# EAGLE design IvoOerlikon3 (EAGLE 7.6.0)

## Sheet 1 of 2
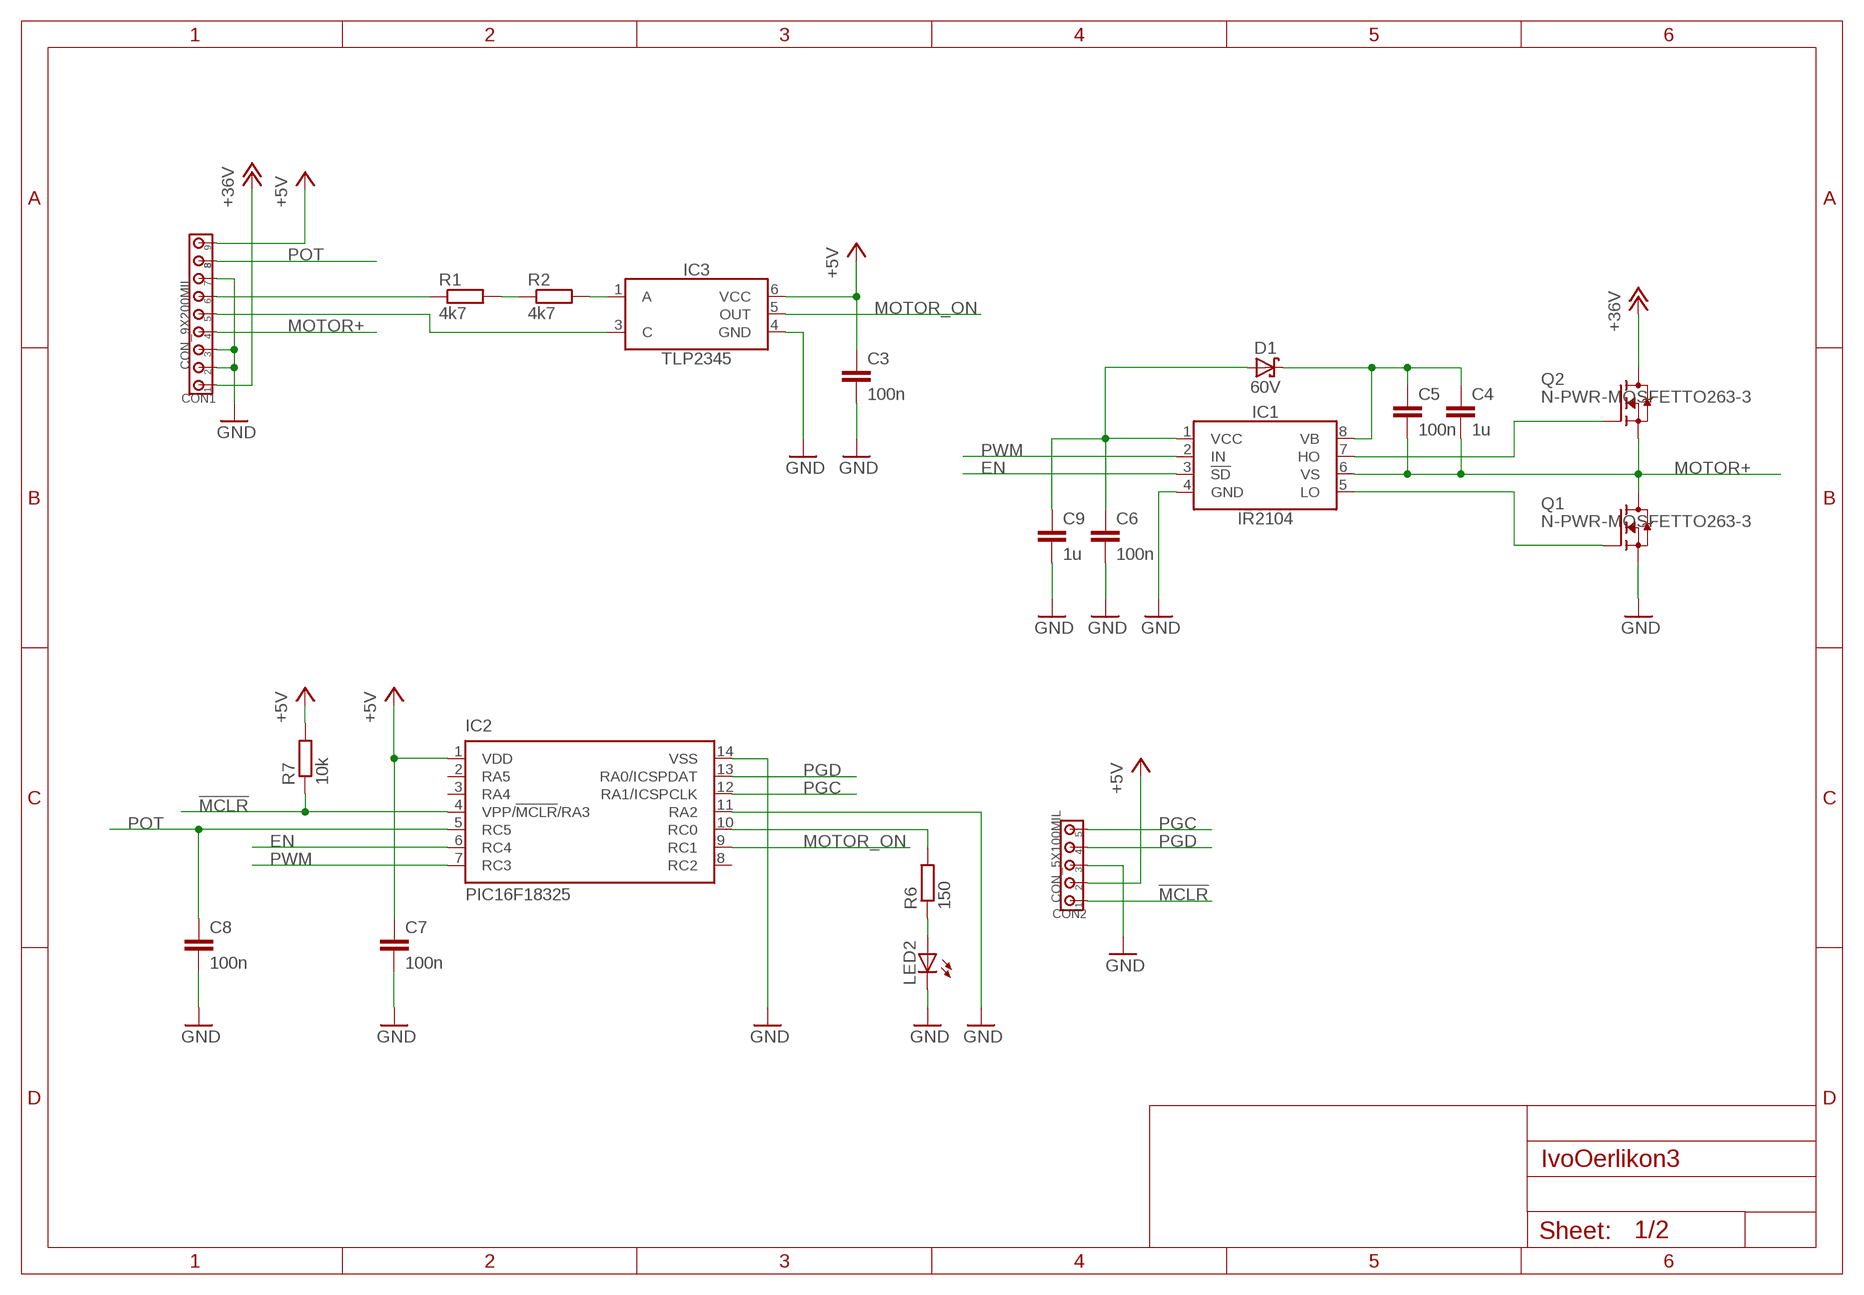
[diagram p0: schematic, sheet 1]

### Parts
C3  100n  CC0805  [C0805]
C4  1u  CC0805  [C0805]
C5  100n  CC0805  [C0805]
C6  100n  CC0805  [C0805]
C7  100n  CC0805  [C0805]
C8  100n  CC0805  [C0805]
C9  1u  CC0805  [C0805]
CON1  CON_9X200MIL  [200MIL_9X]
CON2  CON_5X100MIL  [100MIL_5X]
D1  60V  SCHOTTKYSOD123  [SOD123]
IC1  IR2104  [SOIC8]
IC2  PIC16F18325  [SO14]
IC3  TLP2345  [SO6]
LED2  LED0805  [LED0805]
Q1  N-PWR-MOSFETTO263-3  [TO263-3]
Q2  N-PWR-MOSFETTO263-3  [TO263-3]
R1  4k7  RESISTORR1206  [R1206]
R2  4k7  RESISTORR1206  [R1206]
R6  150  RESISTORR0805  [R0805]
R7  10k  RESISTORR0805  [R0805]

### Nets
!MCLR!: CON2.1 IC2.4(VPP/!MCLR!/RA3) R7.1
+5V: C3.1 C7.1 CON1.9 CON2.2 IC2.1(VDD) IC3.6(VCC) R7.2 ; also sheet 2
+36V: CON1.1 Q2.TAB(D) ; also sheet 2
EN: IC1.3(!SD!) IC2.6(RC4)
GND: C3.2 C6.2 C7.2 C8.2 C9.2 CON1.2 CON1.3 CON1.7 CON2.3 IC1.4(GND) IC2.11(RA2) IC2.14(VSS) IC3.4(GND) LED2.C Q1.3(S) ; also sheet 2
MOTOR+: C4.2 C5.2 CON1.4 IC1.6(VS) Q1.TAB(D) Q2.3(S)
MOTOR_ON: IC2.9(RC1) IC3.5(OUT)
N$1: R1.2 R2.1
N$2: IC1.5(LO) Q1.1(G)
N$4: IC3.1(A) R2.2
N$6: IC1.7(HO) Q2.1(G)
N$8: C4.1 C5.1 D1.C IC1.8(VB)
N$11: LED2.A R6.1
N$12: IC2.10(RC0) R6.2
N$13: CON1.6 R1.1
N$14: CON1.5 IC3.3(C)
N$17: C6.1 C9.1 D1.A IC1.1(VCC)
PGC: CON2.5 IC2.12(RA1/ICSPCLK)
PGD: CON2.4 IC2.13(RA0/ICSPDAT)
POT: C8.1 CON1.8 IC2.5(RC5)
PWM: IC1.2(IN) IC2.7(RC3)
Unconnected: IC2.2(RA5) IC2.3(RA4) IC2.8(RC2)

## Sheet 2 of 2
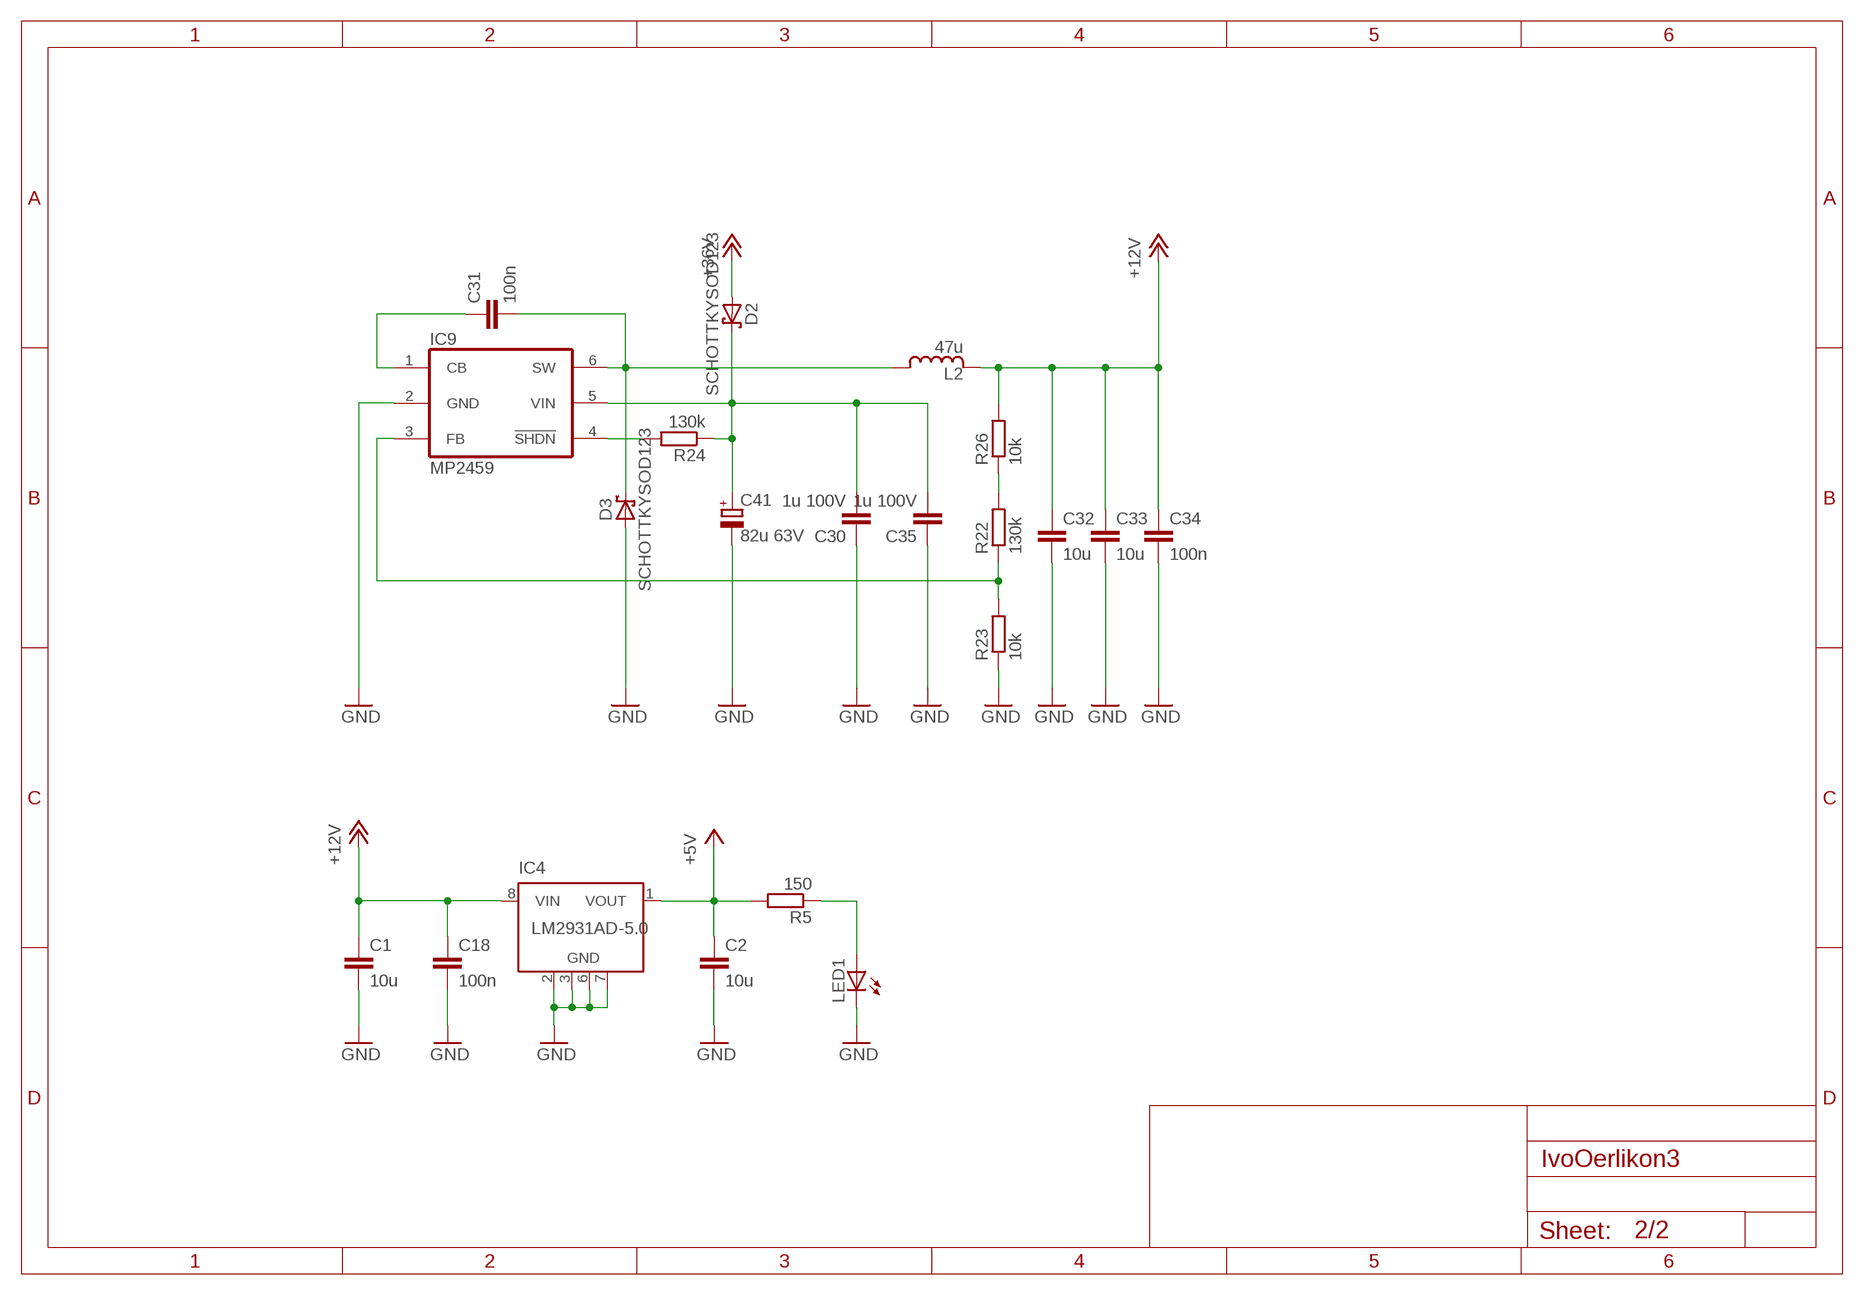
[diagram p1: schematic, sheet 2]

### Parts
C1  10u  CC1206  [C1206]
C2  10u  CC1206  [C1206]
C18  100n  CC0805  [C0805]
C30  1u 100V  CC0805  [C0805]
C31  100n  CC0805  [C0805]
C32  10u  CC1206  [C1206]
C33  10u  CC1206  [C1206]
C34  100n  CC0805  [C0805]
C35  1u 100V  CC0805  [C0805]
C41  82u 63V  C_POLARIZED8MM  [8MM]
D2  SCHOTTKYSOD123  [SOD123]
D3  SCHOTTKYSOD123  [SOD123]
IC4  LM2931AD-5.0  [SOIC8]
IC9  MP2459  LMR16006  [SOT-32-6]
L2  47u  INDUCTORSRN5040  [SRN5040]
LED1  LED0805  [LED0805]
R5  150  RESISTORR0805  [R0805]
R22  130k  RESISTORR0805  [R0805]
R23  10k  RESISTORR0805  [R0805]
R24  130k  RESISTORR0805  [R0805]
R26  10k  RESISTORR0805  [R0805]

### Nets
+5V: C2.1 IC4.1(VOUT) R5.2 ; also sheet 1
+12V: C1.1 C18.1 C32.1 C33.1 C34.1 IC4.8(VIN) L2.2 R26.2
+36V: D2.A ; also sheet 1
GND: C1.2 C2.2 C18.2 C30.1 C32.2 C33.2 C34.2 C35.1 C41.- D3.A IC4.2(GND) IC4.3(GND) IC4.6(GND) IC4.7(GND) IC9.2(GND) LED1.C R23.1 ; also sheet 1
N$5: LED1.A R5.1
N$16: IC9.4(!SHDN!) R24.2
N$18: C31.1 IC9.1(CB)
N$19: IC9.3(FB) R22.1 R23.2
N$20: R22.2 R26.1
SWITCH1: C31.2 D3.C IC9.6(SW) L2.1
VIN [24V]: C30.2 C35.2 C41.+ D2.C IC9.5(VIN) R24.1

## Library data of the parts
C1-C9 C18 C30-C35 = 00Capacitor:C: Capacitor
C41 = 00Capacitor:C_POLARIZED
CON1 = 00Connector:CON_9X: 9-pin header
CON2 = 00Connector:CON_5X: 5-pin header
D1-D3 = 00Diode:SCHOTTKY
IC1 = 00Logic:IR2104: Half-Bridge Driver Up to +600V Gate drive supply 10-20V Deadtime 520ns
IC2 = 00PIC:PIC16F18325
IC3 = 00Logic:TLP2345: Optocoupler
IC4 = 00VoltageRegulator:LM2931*
IC9 = 00VoltageRegulator:LMR16006: 60 V 0.6 A Buck Regulator
L2 = 00Inductor:INDUCTOR
LED1 LED2 = 00Display:LED: LED
Q1 Q2 = 00Mosfet:N-PWR-MOSFET
R1 R2 R5-R7 R22-R24 R26 = 00Resistor:RESISTOR: RESISTOR, European symbol

## Net classes
1 24V: clearance 0.305 mm
2 relay: width 1.778 mm, drill 1.3 mm, clearance 1 mm to class 0, clearance 1 mm to class 1, clearance 1 mm
5 +5v: width 0.61 mm, drill 0.6 mm, clearance 0.254 mm to class 0, clearance 0.254 mm to class 1, clearance 0.254 mm to class 2, clearance 0.254 mm to class 3, clearance 0.254 mm to class 4, clearance 0.254 mm

## Board
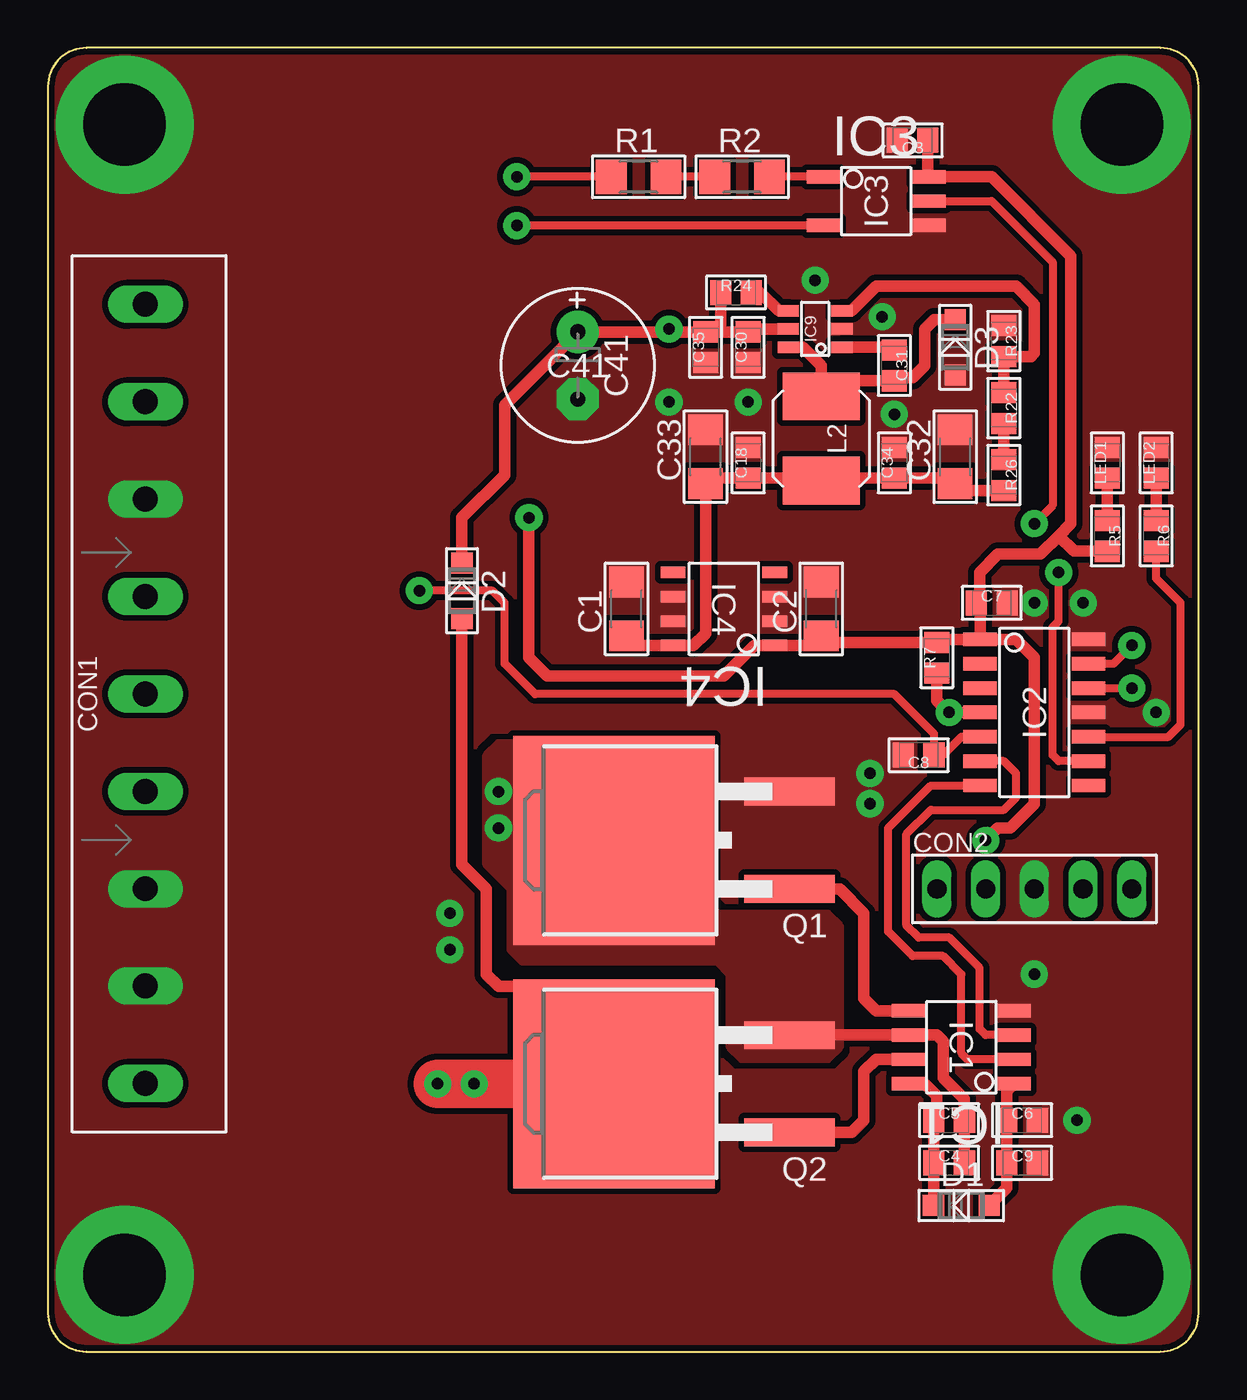
[diagram p2: board, top side]
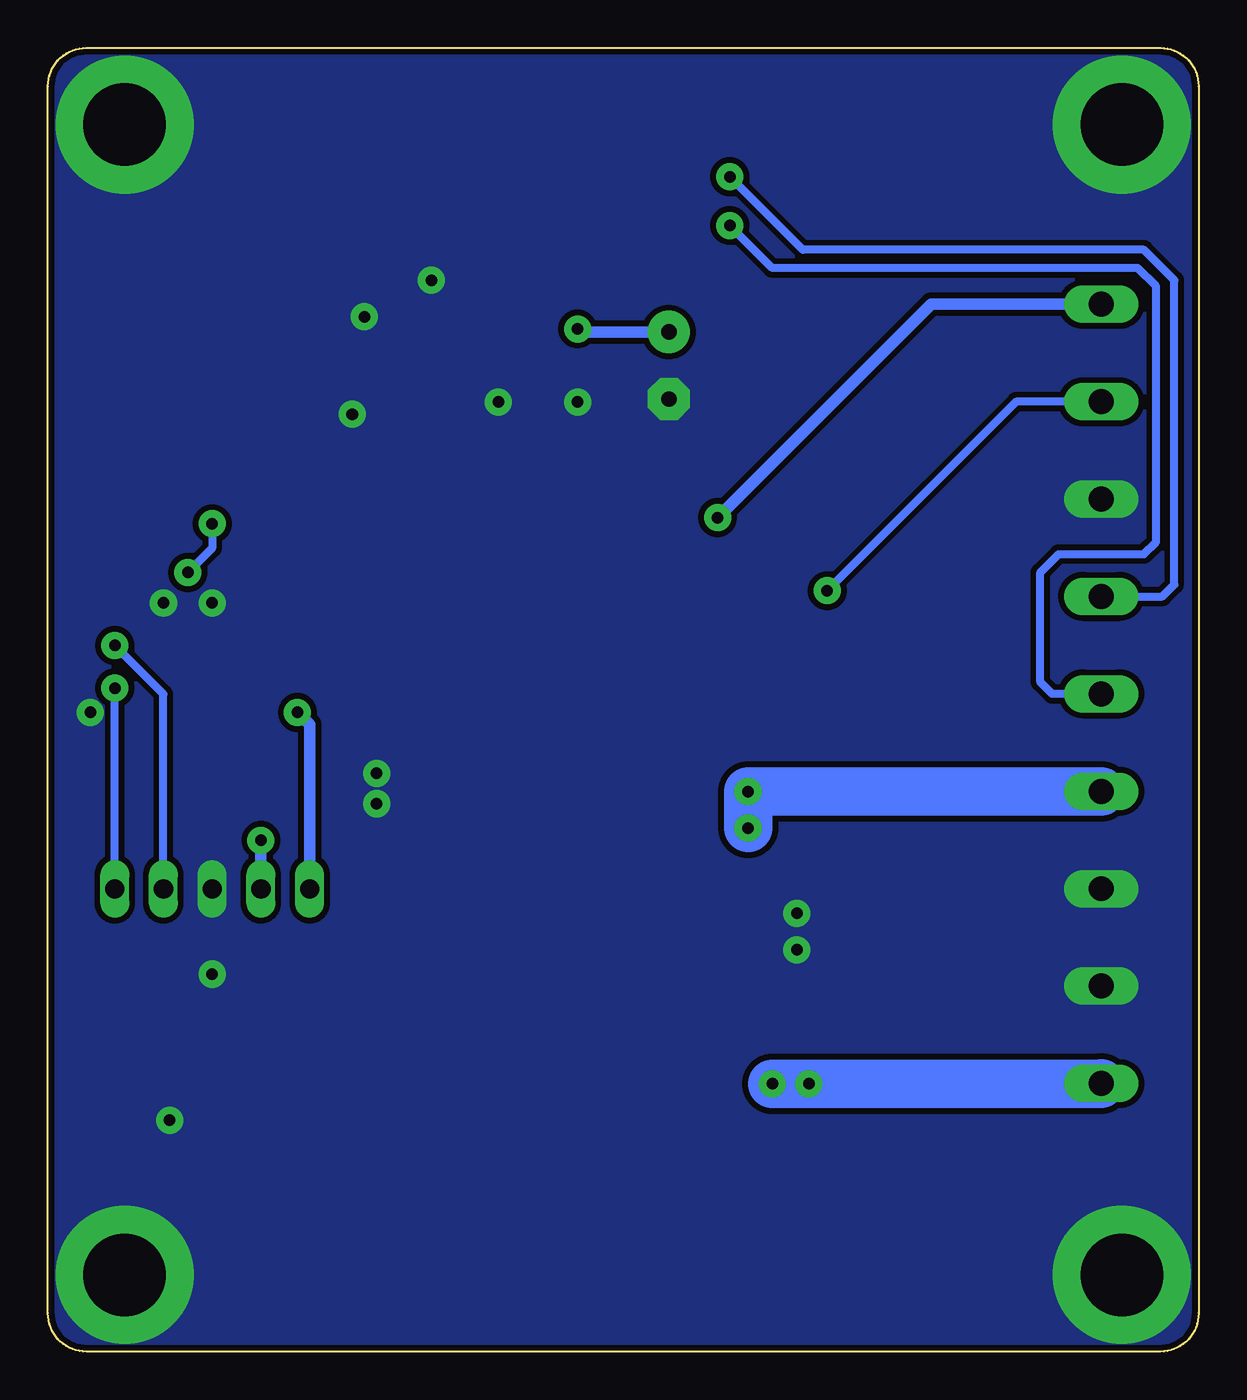
[diagram p3: board, bottom side, seen from below]

Size 60 x 68 mm. Coordinates in mm from the lower left corner, seen from the top.
Outline: 58,0 arc90 60,2 60,66 arc90 58,68 2,68 arc90 0,66 0,2 arc90 2,0 58,0
Copper layers (1*16): Top 0.035mm / dielectric 1.5mm / Bottom 0.035mm
Design rules "LPKF_Compatible *": minimum track width 8mil, minimum drill 23mil, track to track 8mil, track to pad 10mil, pad to pad 10mil, via to via 10mil, smd to smd 0mil, copper to edge 10mil, drill to drill 10mil, minimum pad ring 10mil, minimum via ring 16mil, stop-mask expansion 2mil, vias tented up to drill 25mil, thermal gap 10mil

### Footprints (pad centres in the part's own frame; a part is rotated, then mirrored left to right if it is on the bottom)
C1206 = smd 1.6 x 1.8: 1 -1.4,0; 2 1.4,0
C0805 = smd 1.1 x 1.3: 1 -0.8,0; 2 0.8,0
8MM = drill 0.8 pad 2.2: + -1.75,0 | drill 0.8 pad 2.2 octagon: - 1.75,0
200MIL_9X = drill 1.3 long: 1 -20.32,0; 2 -15.24,0; 3 -10.16,0; 4 -5.08,0; 5 0,0; 6 5.08,0; 7 10.16,0; 8 15.24,0; 9 20.32,0
100MIL_5X = drill 1 long: 1 -5.08,0; 2 -2.54,0; 3 0,0; 4 2.54,0; 5 5.08,0
SOD123 = smd 1.1 x 1.1: A 1.45,0; C -1.45,0
SOIC8 = smd 1.75 x 0.7: 1 -2.75,1.905; 2 -2.75,0.635; 3 -2.75,-0.635; 4 -2.75,-1.905; 5 2.75,-1.905; 6 2.75,-0.635; 7 2.75,0.635; 8 2.75,1.905
SO14 = smd 0.7 x 1.75: 1 -3.81,-2.825; 2 -2.54,-2.825; 3 -1.27,-2.825; 4 0,-2.825; 5 1.27,-2.825; 6 2.54,-2.825; 7 3.81,-2.825; 8 3.81,2.825; 9 2.54,2.825; 10 1.27,2.825; 11 0,2.825; 12 -1.27,2.825; 13 -2.54,2.825; 14 -3.81,2.825
SO6 = smd 1.75 x 0.7: 1 -2.75,1.27; 3 -2.75,-1.27; 4 2.75,-1.27; 5 2.75,0; 6 2.75,1.27
SOIC8' = smd 1.3 x 0.6: 1 -2.65,1.905; 2 -2.65,0.635; 3 -2.65,-0.635; 4 -2.65,-1.905; 5 2.65,-1.905; 6 2.65,-0.635; 7 2.65,0.635; 8 2.65,1.905
SOT-32-6 = smd 0.6 x 1.1: 1 -0.95,-1.4; 2 0,-1.4; 3 0.95,-1.4; 4 0.95,1.4; 5 0,1.4; 6 -0.95,1.4
SRN5040 = smd 2.5 x 4: 1 -2.2,0; 2 2.2,0
LED0805 = smd 1.1 x 1.3: A -0.8,0; C 0.8,0
TO263-3 = smd 1.45 x 4.7: 1 -2.54,-5.65; 3 2.54,-5.65 | smd 10.9 x 10.5: TAB 0,3.5
R1206 = smd 1.6 x 1.803: 1 -1.422,0; 2 1.422,0
R0805 = smd 1.1 x 1.3: 1 -0.8,0; 2 0.8,0

### Placement (x,y rotation side)
C1  30.16,38.73 90 top
C2  40.32,38.73 90 top
C3  45.09,63.18 180 top
C4  46.99,9.84 0 top
C5  46.99,12.06 0 top
C6  50.8,12.06 0 top
C7  49.21,39.05 0 top
C8  45.4,31.11 180 top
C9  50.8,9.84 0 top
C18  36.51,46.35 90 top
C30  36.51,52.39 90 top
C31  44.13,51.44 270 top
C32  47.31,46.67 90 top
C33  34.29,46.67 90 top
C34  44.13,46.35 90 top
C35  34.29,52.39 90 top
C41  27.62,51.44 270 top
CON1  5.08,34.3 90 top
CON2  51.44,24.13 0 top
D1  47.62,7.62 0 top
D2  21.59,39.69 270 top
D3  47.31,52.39 270 top
IC1  47.62,15.88 180 top
IC2  51.44,33.34 270 top
IC3  43.18,60.01 0 top
IC4  LM2931AD-5.0  [SOIC8']  35.24,38.73 180 top
IC9  40.01,53.34 90 top
L2  40.32,47.62 270 top
LED1  55.24,46.35 90 top
LED2  57.78,46.35 90 top
Q1  33.02,26.67 90 top
Q2  33.02,13.97 90 top
R1  30.8,61.28 0 top
R2  36.2,61.28 0 top
R5  55.24,42.55 270 top
R6  57.78,42.55 270 top
R7  46.35,36.2 90 top
R22  49.85,49.21 270 top
R23  49.85,52.7 270 top
R24  35.88,55.24 0 top
R26  49.85,45.72 270 top

### Tracks (layer width: path | path; a pad name or v marks a point on that pad's centre or on a via)
!MCLR!  (via drill 0.6)
  Top 0.61: R7.1 46.35,33.97 v46.99,33.34 IC2.4
  Bottom 0.61: v46.99,33.34 46.35,32.7 CON2.1
+5V  (via drill 0.6)
  Top 0.61: C2.1 39.82,36.83 IC4.1 36.83,36.83 35.24,35.24 26.04,35.24 25.08,36.2 v25.08,43.5 | C3.1 45.88,61.32 IC3.6 49.21,61.28 53.34,57.15 53.34,43.18 52.7,42.55 | 52.7,42.55 51.75,41.59 49.53,41.59 48.58,40.64 48.58,39.22 C7.1 48.61,38.85 IC2.1 | R5.2 53.51,41.74 52.7,42.55 | IC2.1 46.51,37.15 R7.2 40.66,36.99 C2.1 | 40.83,36.83 C2.1 | IC2.1 50.48,37.15 51.44,36.2 51.44,28.57 50.16,27.3 49.53,27.3 v48.9,26.67
  Bottom 0.61: CON1.9 13.96,54.62 v25.08,43.5 | v48.9,26.67 CON2.2
+12V
  Top 0.61: C1.1 30.67,36.83 IC4.8 33.66,36.83 34.29,37.47 C33.1 34.57,45.55 C18.1 40.19,45.55 L2.2 40.45,45.55 C34.1 47.02,45.55 C32.1 47.66,44.92 R26.2
+36V  (via drill 0.6)
  Top 0.61: Q2.TAB 29.52,14.29 24.77,19.05 23.5,19.05 22.86,19.68 22.86,24.13 21.59,25.4 D2.A
  Top 2.54: v20.32,13.97 v22.23,13.97 Q2.TAB
  Bottom 2.54: CON1.1 5.09,13.97 v20.32,13.97 v22.23,13.97
EN
  Top 0.406: IC1.3 48.9,16.51 48.58,16.83 48.58,20 46.99,21.59 45.4,21.59 44.77,22.23 44.77,26.99 46.04,28.26 49.85,28.26 50.48,28.89 50.48,30.16 49.85,30.8 IC2.6
GND  (via drill 0.6, 4.3 pad 7.2)
  other vias: 4,64 56,64 56,4 4,4 20.95,22.86 20.95,20.95 42.86,30.16 42.86,28.57 51.44,19.68 53.66,12.06 51.44,39.05 53.98,39.05 32.38,49.53 36.51,49.53 44.13,48.9 40.01,55.88 57.78,33.34 43.5,53.98
  pour Bottom (isolate 0.305, rank 3, no thermals): 58,0 2,0 arc-90 0,2 0,66 arc-90 2,68 58,68 arc-90 60,66 60,2 arc-90
  pour Top (isolate 0.305, rank 3, no thermals): 0,2 0,66 arc-90 2,68 58,68 arc-90 60,66 60,2 arc-90 58,0 2,0 arc-90
MOTOR+  (via drill 0.6)
  Top 0.61: Q2.3 IC1.6 46.35,16.51 46.67,16.19 46.67,14.29 47.79,13.17 C5.2 C4.2
  Bottom 2.54: CON1.4 5.09,29.21 v23.5,29.21 v23.5,27.3
  pour Top (no thermals): 23.5,31.75 34.29,31.75 34.29,23.5 34.92,22.86 40.64,22.86 41.27,22.23 41.27,15.88 40.64,15.24 36.2,15.24 35.56,15.88 35.56,19.68 34.92,20.32 24.77,20.32 24.13,20.95 24.13,24.13 22.86,25.4 22.86,31.11
MOTOR_ON  (via drill 0.6)
  Top 0.406: IC3.5 49.21,60.01 52.39,56.83 52.39,44.13 v51.44,43.18 | IC2.9 52.7,30.8 52.39,31.11 52.39,37.78 52.7,38.1 v52.7,40.64
  Bottom 0.406: v51.44,43.18 51.44,41.91 v52.7,40.64
N$1
  Top 0.406: R2.1 R1.2
N$2
  Top 0.61: IC1.5 43.18,17.78 42.55,18.41 42.55,22.86 41.27,24.13 Q1.1
N$4
  Top 0.406: IC3.1 R2.2
N$5
  Top 0.61: R5.1 LED1.A
N$6
  Top 0.61: Q2.1 41.91,11.43 42.55,12.06 42.55,14.61 43.18,15.24 IC1.7
N$8
  Top 0.61: IC1.8 45.72,13.97 46.35,13.34 46.35,12.23 C5.1 C4.1 46.19,7.63 D1.C
N$11
  Top 0.61: LED2.A R6.1
N$12
  Top 0.406: IC2.10 58.42,32.07 59.05,32.7 59.05,39.05 57.78,40.32 R6.2
N$13  (via drill 0.6)
  Top 0.406: R1.1 v24.45,61.28
  Bottom 0.406: CON1.6 1.89,39.38 1.27,40.01 1.27,55.88 2.86,57.47 20.64,57.47 v24.45,61.28
N$14  (via drill 0.6)
  Top 0.406: IC3.3 v24.45,58.74
  Bottom 0.406: CON1.5 7.63,34.3 8.26,34.92 8.26,40.64 7.3,41.59 2.86,41.59 2.22,42.23 2.22,55.56 3.17,56.52 22.23,56.52 v24.45,58.74
N$16
  Top 0.61: R24.2 37.15,55.24 38.1,54.29 IC9.4
N$17
  Top 0.61: IC1.1 50,13.6 C6.1 C9.1 50,8.54 D1.A
N$18
  Top 0.61: IC9.1 43.98,52.39 C31.1
N$19
  Top 0.61: R22.1 R23.2 51.27,51.91 51.44,52.07 51.44,54.61 50.48,55.56 43.18,55.56 41.91,54.29 IC9.3
N$20
  Top 0.61: R26.1 R22.2
PGC  (via drill 0.6)
  Top 0.406: IC2.12 v56.52,34.61
  Bottom 0.406: CON2.5 v56.52,34.61
PGD  (via drill 0.6)
  Top 0.406: IC2.13 55.56,35.88 v56.52,36.83
  Bottom 0.406: CON2.4 53.98,34.29 v56.52,36.83
POT  (via drill 0.6)
  Top 0.406: IC2.5 47.62,32.07 46.67,31.11 C8.1 46.2,32.22 44.13,34.29 25.4,34.29 23.81,35.88 23.81,39.05 23.18,39.69 v19.37,39.69
  Bottom 0.406: CON1.8 9.51,49.55 v19.37,39.69
PWM
  Top 0.406: IC1.2 47.94,15.24 47.62,15.56 47.62,19.68 46.67,20.64 45.09,20.64 43.81,21.91 43.81,27.3 46.04,29.53 IC2.7
SWITCH1
  Top 0.61: IC9.6 39.37,52.39 40.32,51.44 L2.1 41.13,50.63 C31.2 44.3,50.8 45.09,50.8 45.72,51.44 45.72,53.34 46.22,53.84 D3.C
VIN  (via drill 0.6)
  Top 0.61: IC9.5 36.51,53.34 C30.2 C35.2 | C35.2 35.08,53.19 R24.1 | C35.2 32.54,53.19 v32.38,53.34 32.23,53.19 C41.+ 23.81,49.38 23.81,45.72 21.59,43.5 D2.C
  Bottom 0.61: C41.+ 32.23,53.19 v32.38,53.34

### Text on the board
tText: Pot+ | PotWiper | Power | Feed | Pot- | In+ | In- | Motor+ | Motor- | GND | 36V | Ivo's Oerlikon v2